# EAGLE design music (EAGLE 9.3.0)
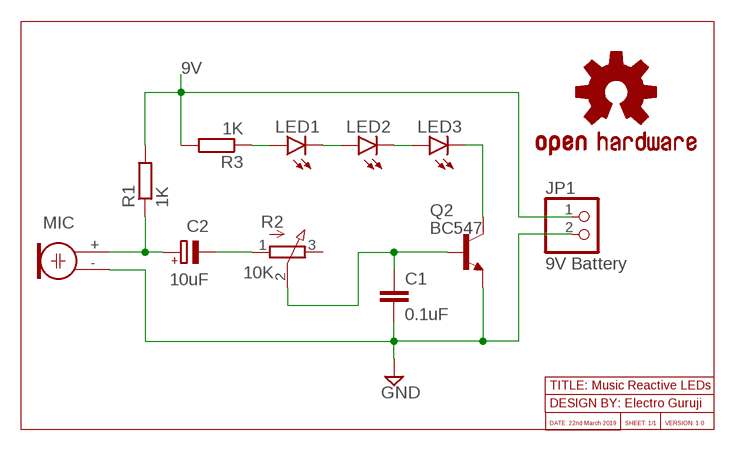
[diagram p0: schematic, sheet 1]

## Parts
C1  0.1uF  C-EU025-050X050  [C025-050X050]
C2  10uF  CPOL-EUE2.5-6  [E2,5-6]
JP1  9V Battery  PINHD-1X2  [1X02]
LED1  LED5MM  [LED5MM]
LED2  LED5MM  [LED5MM]
LED3  LED5MM  [LED5MM]
LOGO1  OSHW-LOGOMINI  [OSHW-LOGO-MINI]
MIC  ELECTRET  [9.7ELECTRET]
Q2  BC547  -NPN-TO92-CBE  [TO92-CBE]
R1  1K  R-EU_0207/10  [0207/10]
R2  10K  3RP/1610N  [3RP/1610N]
R3  1K  R-EU_0207/10  [0207/10]

## Nets
9V: JP1.1 R1.2 R3.2
GND: C1.2 JP1.2 MIC.- Q2.E
N$1: C2.+ MIC.+ R1.1
N$2: C2.- R2.1(A)
N$3: C1.1 Q2.B R2.2(S)
N$6: LED3.K(C) Q2.C
N$7: LED1.A R3.1
N$8: LED1.K(C) LED2.A
N$9: LED2.K(C) LED3.A
Unconnected: R2.3(E)

## Notes on the sheet
- TITLE: Music Reactive LEDs
- DESIGN BY: Electro Guruji
- DATE: 22nd March 2019 | SHEET: 1/1 | VERSION: 1.0

## Library data of the parts
C1 = resistor:C-EU: CAPACITOR, European symbol
C2 = resistor:CPOL-EU: POLARIZED CAPACITOR, European symbol
JP1 = pinhead:PINHD-1X2: PIN HEADER
LED1-LED3 = led:LED: LED OSRAM: - CHIPLED LG R971, LG N971, LY N971, LG Q971, LY Q971, LO R971, LY R971 LH N974, LH R974 LS Q976, LO Q976, LY Q976 LO Q996 - Hyper CHIPLED LW Q18S LB Q993, LB Q99A, LB R99A - SideLED LS A670, LO A670, LY A670, LG A670, LP A670 LB A673, LV A673, LT A673, LW A673 LH A674 LY A675 LS A676, LA A676, LO A676, LY A676, LW A676 LS A679, LY A679, LG A679 - Hyper Micro SIDELED® LS Y876, LA Y876, LO Y876, LY Y876 LT Y87S - SmartLED LW L88C, LW L88S LB L89C, LB L89S, LG L890 LS L89K, LO L89K, LY L89K LS L896, LA L896, LO L896, LY L896 - TOPLED LS T670, LO T670, LY T670, LG T670, LP T670 LSG T670, LSP T670, LSY T670, LOP T670, LYG T670 LG T671, LOG T671, LSG T671 LB T673, LV T673, LT T673, LW T673 LH T674 LS T676, LA T676, LO T676, LY T676, LB T676, LH T676, LSB T676, LW T676 LB T67C, LV T67C, LT T67C, LS T67K, LO T67K, LY T67K, LW E67C LS E67B, LA E67B, LO E67B, LY E67B, LB E67C, LV E67C, LT E67C LW T67C LS T679, LY T679, LG T679 LS T770, LO T770, LY T770, LG T770, LP T770 LB T773, LV T773, LT T773, LW T773 LH T774 LS E675, LA E675, LY E675, LS T675 LS T776, LA T776, LO T776, LY T776, LB T776 LHGB T686 LT T68C, LB T68C - Hyper Mini TOPLED® LB M676 - Mini TOPLED Santana® LG M470 LS M47K, LO M47K, LY M47K Source: http://www.osram.convergy.de LUXEON: - LUMILED® LXK2-PW12-R00, LXK2-PW12-S00, LXK2-PW14-U00, LXK2-PW14-V00 LXK2-PM12-R00, LXK2-PM12-S00, LXK2-PM14-U00 LXK2-PE12-Q00, LXK2-PE12-R00, LXK2-PE12-S00, LXK2-PE14-T00, LXK2-PE14-U00 LXK2-PB12-K00, LXK2-PB12-L00, LXK2-PB12-M00, LXK2-PB14-N00, LXK2-PB14-P00, LXK2-PB14-Q00 LXK2-PR12-L00, LXK2-PR12-M00, LXK2-PR14-Q00, LXK2-PR14-R00 LXK2-PD12-Q00, LXK2-PD12-R00, LXK2-PD12-S00 LXK2-PH12-R00, LXK2-PH12-S00 LXK2-PL12-P00, LXK2-PL12-Q00, LXK2-PL12-R00 Source: www.luxeon.com KINGBRIGHT: KA-3528ASYC Source: www.kingbright.com
LOGO1 = SparkFun-Aesthetics:OSHW-LOGO: Open-Source Hardware (OSHW) Logo This logo indicates the piece of hardware it is found on incorporates a OSHW license and/or adheres to the definition of open source hardware found here: http://freedomdefined.org/OSHW
MIC = adafruit:ELECTRET: Electret microphone Thru hole 2.54mm spacing with 9.7mm diameter
Q2 = transistor-neu-to92:*-NPN-: NPN Transistror
R1 R3 = resistor:R-EU_: RESISTOR, European symbol
R2 = pot:3RP/1610N: 16mm Potentiometer one level Source: http://www.alphapotentiometers.net/html/16mm_pot_2.html

## Board
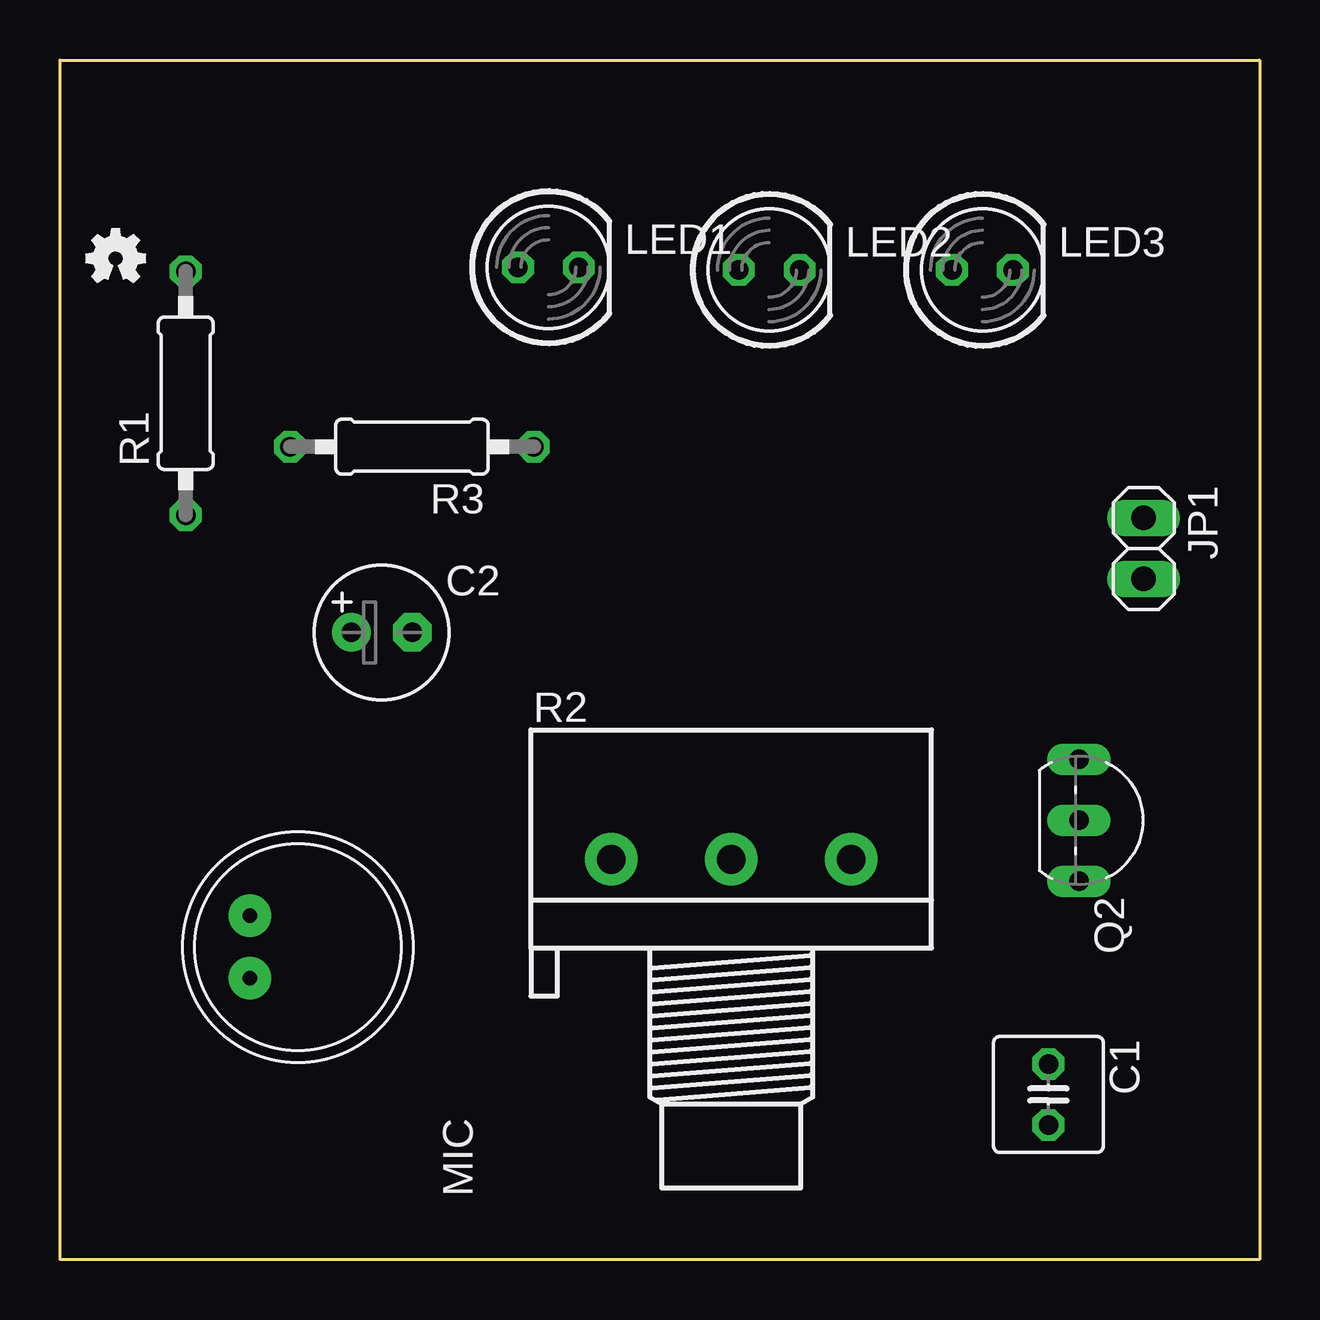
[diagram p1: board, top side]
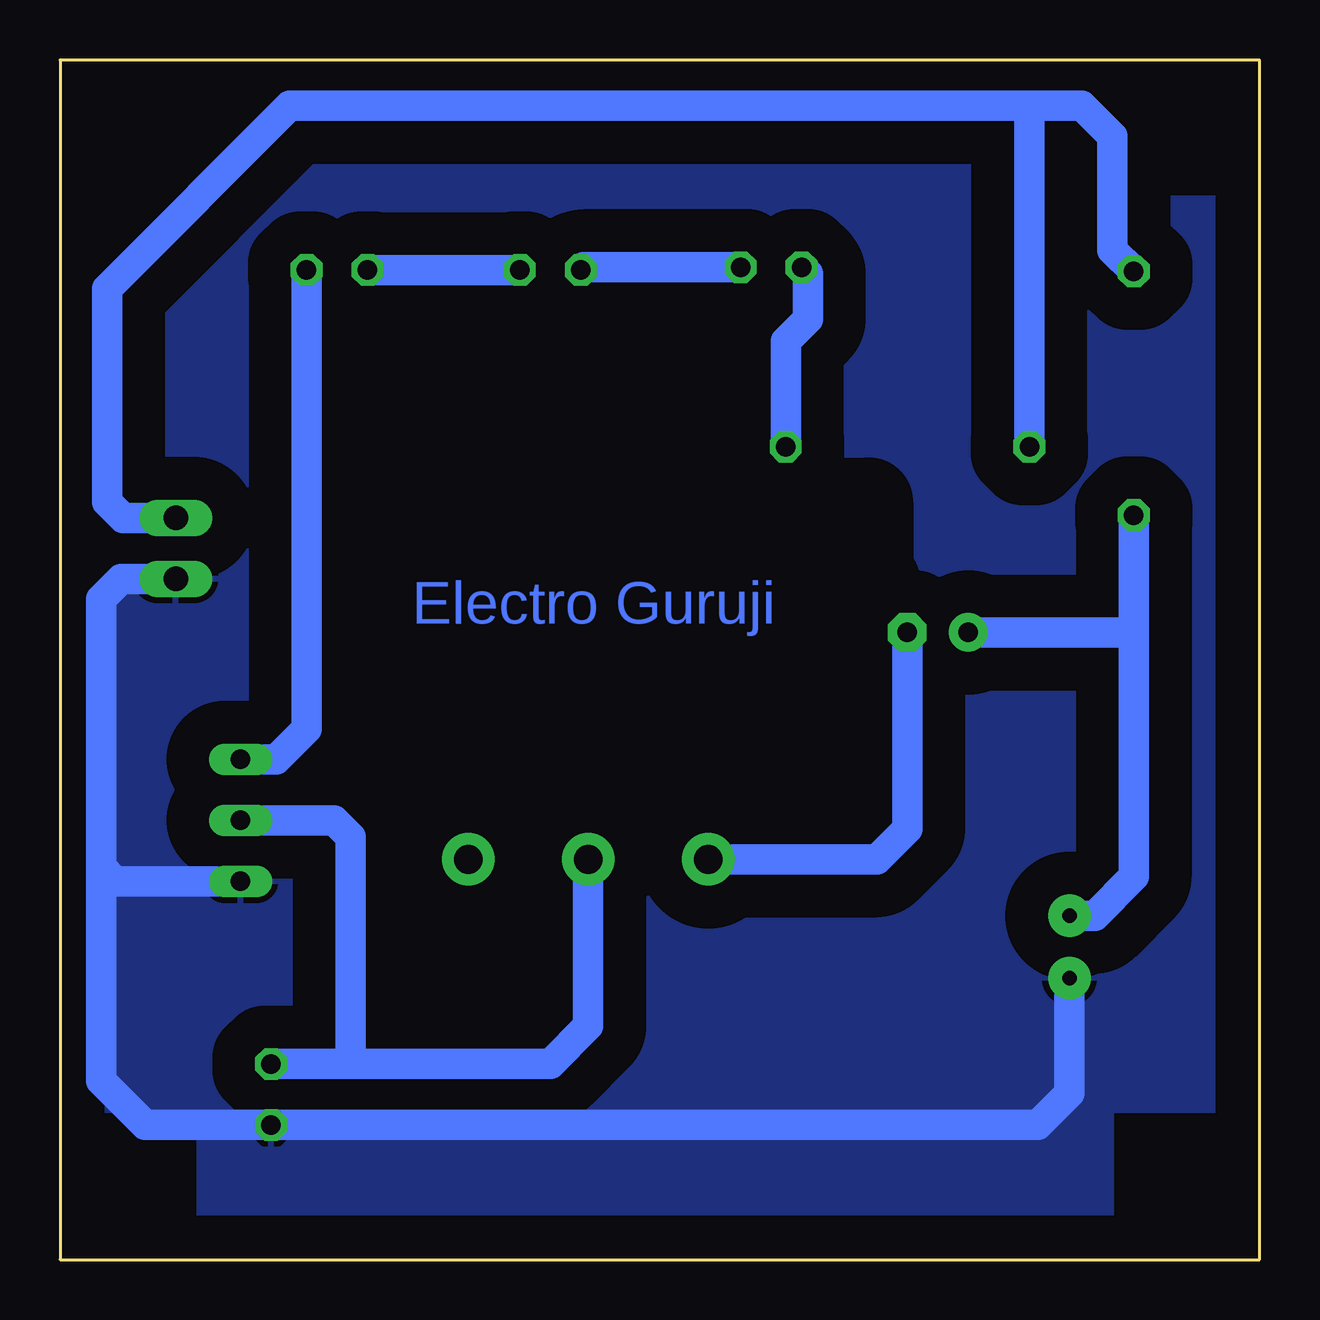
[diagram p2: board, bottom side, seen from below]

Size 50 x 50 mm. Coordinates in mm from the lower left corner, seen from the top.
Outline: 0,50 50,50 50,0 0,0 0,50
Copper layers (1*16): Top 0.035mm / dielectric 1.5mm / Bottom 0.035mm
Design rules "default": minimum track width 6mil, minimum drill 0.35mm, track to track 6mil, track to pad 6mil, pad to pad 6mil, via to via 6mil, smd to smd 6mil, copper to edge 40mil, drill to drill 6mil, minimum pad ring 10mil, minimum via ring 8mil, stop-mask expansion 4mil, vias tented up to drill 0mil, thermal gap 10mil
bRestrict: area 16.3,18.9 to 37.9,39.2

### Footprints (pad centres in the part's own frame; a part is rotated, then mirrored left to right if it is on the bottom)
C025-050X050 = drill 0.813 octagon: 1 -1.27,0; 2 1.27,0
E2,5-6 = drill 0.813 pad 1.6: + -1.27,0 | drill 0.813 pad 1.6 octagon: - 1.27,0
1X02 = drill 1.016 long: 1 -1.27,0; 2 1.27,0
LED5MM = drill 0.813 octagon: A -1.27,0; K 1.27,0
9.7ELECTRET = drill 0.6 pad 1.778: + 1.3,2; - -1.3,2
TO92-CBE = drill 0.813 long: B 0,0; C -2.54,0; E 2.54,0
0207/10 = drill 0.813 octagon: 1 -5.08,0; 2 5.08,0
3RP/1610N = drill 1.2 pad 2.184: 1 -5,0; 2 0,0; 3 5,0

### Placement (x,y rotation side)
C1  41.2,6.88 270 top
C2  13.41,26.14 0 top
JP1  45.17,29.64 270 top
LED1  20.36,41.36 0 top
LED2  29.56,41.25 0 top
LED3  38.45,41.25 0 top
LOGO1  2.32,41.74 0 top
MIC  9.92,13.03 90 top
Q2  42.47,18.31 270 top
R1  5.24,36.11 90 top
R2  27.98,16.68 0 top
R3  14.67,33.88 180 top

### Tracks (layer width: path | path; a pad name or v marks a point on that pad's centre or on a via)
9V
  Bottom 1.27: JP1.1 47.37,30.91 48.04,31.58 48.04,40.47 40.42,48.09 9.94,48.09 | 9.94,48.09 7.4,48.09 6.13,46.82 6.13,42.08 R1.2 | R3.2 9.59,47.74 9.94,48.09
GND
  Bottom 1.27: JP1.2 47.44,28.37 48.28,27.53 48.28,16.34 | 48.28,16.34 48.28,7.45 46.44,5.61 C1.2 9.24,5.61 7.92,6.93 MIC.- | Q2.E 47.72,15.77 48.28,16.34
  pour Bottom (isolate 1.778): 1.05,44.28 6.13,44.28 6.13,48.09 44.23,48.09 44.23,44.28 49.31,44.28 49.31,6.18 44.23,6.18 44.23,1.1 6.13,1.1 6.13,6.18 1.05,6.18
N$1
  Bottom 1.27: R1.1 5.24,26.5 | 5.24,26.5 5.24,15.96 6.87,14.33 MIC.+ | C2.+ 5.6,26.14 5.24,26.5
N$2
  Bottom 1.27: R2.1 15.95,16.68 14.68,17.95 C2.-
N$3
  Bottom 1.27: Q2.B 38.58,18.31 37.88,17.61 37.88,8.15 | R2.2 27.98,9.73 29.56,8.15 37.88,8.15 | 37.88,8.15 C1.1
N$6
  Bottom 1.27: LED3.K 39.72,22.12 40.99,20.85 Q2.C
N$7
  Bottom 1.27: R3.1 19.75,38.28 18.83,39.2 18.83,41.1 LED1.A
N$8
  Bottom 1.27: LED1.K 28.18,41.36 LED2.A
N$9
  Bottom 1.27: LED3.A LED2.K

### Text on the board
Bottom: Electro Guruji